# EAGLE schematic glove (EAGLE 6.6.0)

## Sheet 1 of 4
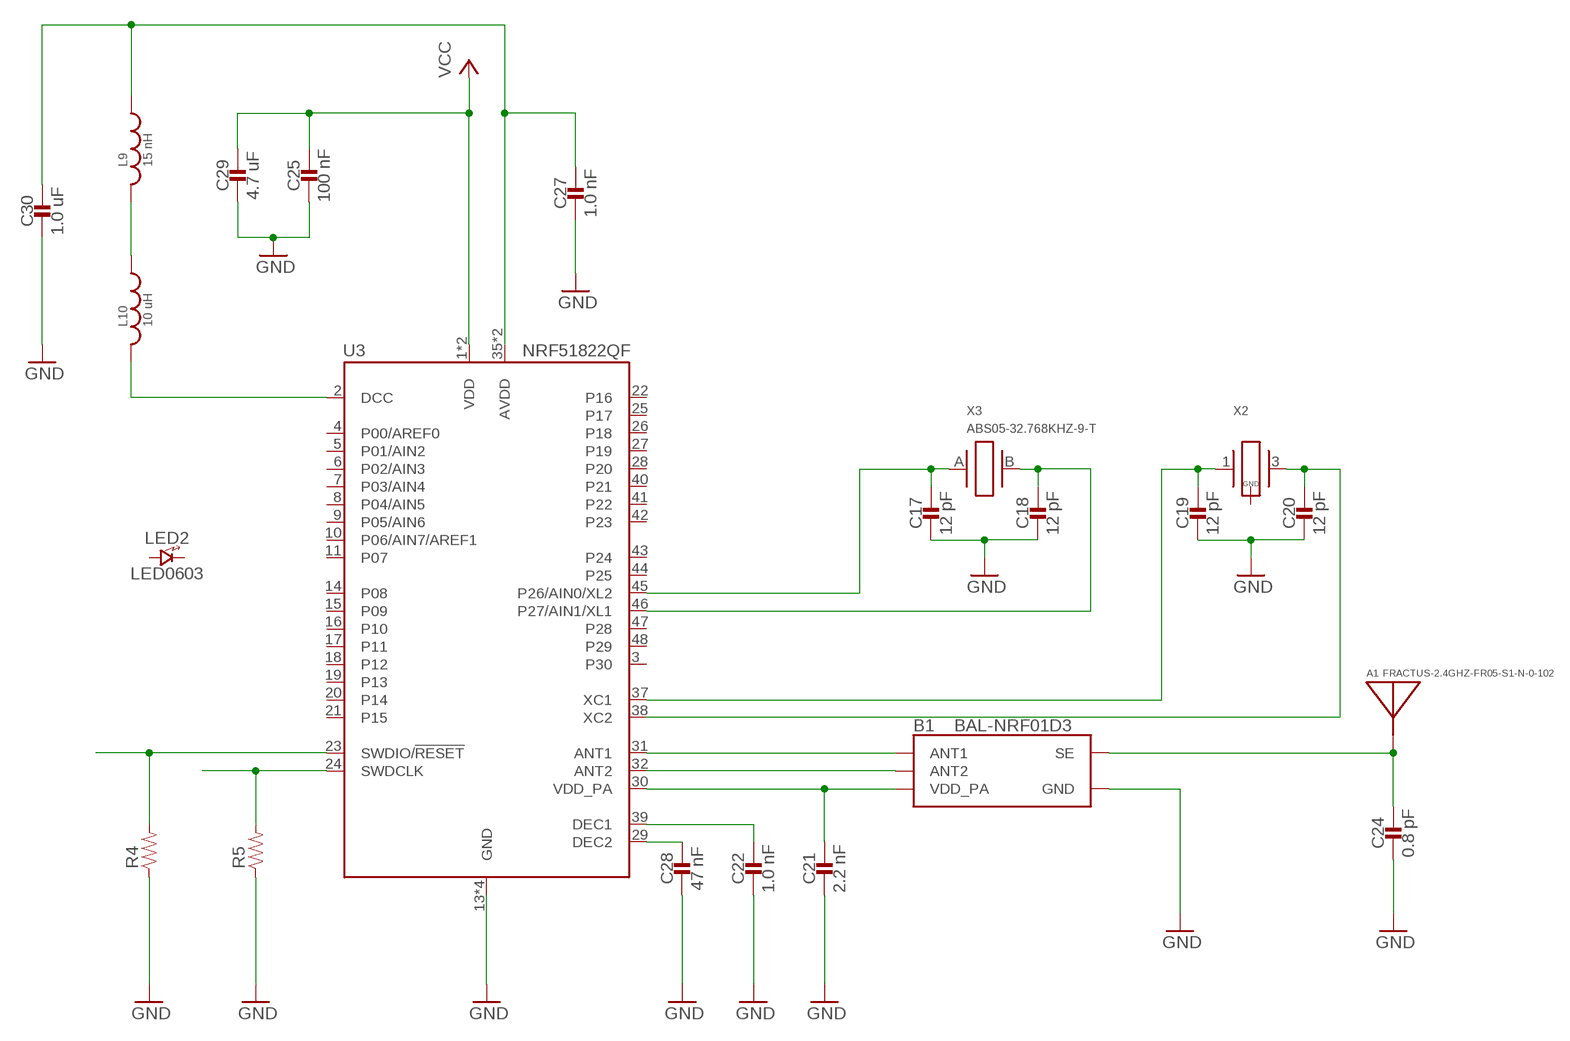
[diagram p0: schematic, sheet 1]

### Parts
A1  FRACTUS-2.4GHZ-FR05-S1-N-0-102  [FRACTUS-ANTENNA-FR05-S1-N-0-102]
B1  BAL-NRF01D3  [BAL-NRF01D3]
C17  12 pF  CAPACITOR0402_CAP  [0402_CAP]
C18  12 pF  CAPACITOR0402_CAP  [0402_CAP]
C19  12 pF  CAPACITOR0402_CAP  [0402_CAP]
C20  12 pF  CAPACITOR0402_CAP  [0402_CAP]
C21  2.2 nF  CAPACITOR0402_CAP  [0402_CAP]
C22  1.0 nF  CAPACITOR0402_CAP  [0402_CAP]
C24  0.8 pF  CAPACITOR0402_CAP  [0402_CAP]
C25  100 nF  CAPACITOR0402_CAP  [0402_CAP]
C27  1.0 nF  CAPACITOR0402_CAP  [0402_CAP]
C28  47 nF  CAPACITOR0402_CAP  [0402_CAP]
C29  4.7 uF  CAPACITOR0603_CAP  [0603_CAP]
C30  1.0 uF  CAPACITOR0603_CAP  [0603_CAP]
L9  15 nH  INDUCTOR0402  [0402_CAP]
L10  10 uH  INDUCTOR0603  [0603_CAP]
LED2  LED0603  [LED-0603]
R4  RESISTOR0603_RES  [0603-RES]
R5  RESISTOR0603_RES  [0603-RES]
U3  NRF51822QF  [QFN-48-6MM]
X2  TXC-8Y  [TXC-8Y]
X3  ABS05-32.768KHZ-9-T  [ABS05]

### Nets
GND: B1.GND C17.2 C18.2 C19.2 C20.2 C21.2 C22.2 C24.2 C25.2 C27.2 C28.2 C29.2 C30.2 R4.1 R5.1 U3.13(GND) U3.33(GND) U3.34(GND) U3.GND ; also sheet 2,3,4
N$14: L10.2 U3.2(DCC)
N$15: L9.2 L10.1
N$16: C27.1 C30.1 L9.1 U3.35(AVDD) U3.36(AVDD)
N$19: R4.2 U3.23(SWDIO/!RESET)
N$20: C20.1 U3.38(XC2) X2.3
N$21: B1.ANT1 U3.31(ANT1)
N$22: B1.ANT2 U3.32(ANT2)
N$23: B1.VCC(VDD_PA) C21.1 U3.30(VDD_PA)
N$24: A1.1(ANTENNA) B1.SE C24.1
N$25: C28.1 U3.29(DEC2)
N$26: C22.1 U3.39(DEC1)
N$27: C17.1 U3.45(P26/AIN0/XL2) X3.A
N$28: C18.1 U3.46(P27/AIN1/XL1) X3.B
N$29: C19.1 U3.37(XC1) X2.1
N$30: R5.2 U3.24(SWDCLK)
VCC: C25.1 C29.1 U3.1(VDD) U3.12(VDD) ; also sheet 3,4
Unconnected: LED2.A(ANODE) LED2.C(CATHODE) U3.3(P30) U3.4(P00/AREF0) U3.5(P01/AIN2) U3.6(P02/AIN3) U3.7(P03/AIN4) U3.8(P04/AIN5) U3.9(P05/AIN6) U3.10(P06/AIN7/AREF1) U3.11(P07) U3.14(P08) U3.15(P09) U3.16(P10) U3.17(P11) U3.18(P12) U3.19(P13) U3.20(P14) U3.21(P15) U3.22(P16) U3.25(P17) U3.26(P18) U3.27(P19) U3.28(P20) U3.40(P21) U3.41(P22) U3.42(P23) U3.43(P24) U3.44(P25) U3.47(P28) U3.48(P29) X2.2(GND) X2.4(GND)

## Sheet 2 of 4
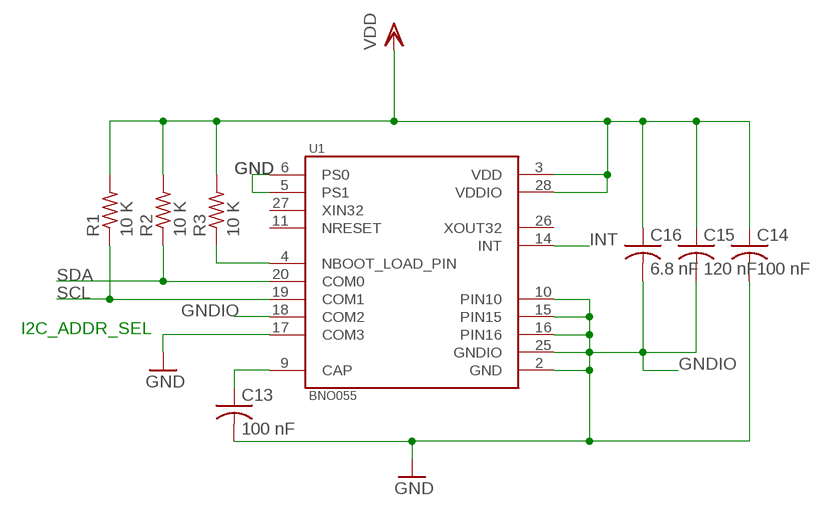
[diagram p1: schematic, sheet 2]

### Parts
C13  100 nF  C-USC0603  [C0603]
C14  100 nF  C-USC0603  [C0603]
C15  120 nF  C-USC0603  [C0603]
C16  6.8 nF  C-USC0603  [C0603]
R1  10 K  R-US_R0603  [R0603]
R2  10 K  R-US_R0603  [R0603]
R3  10 K  R-US_R0603  [R0603]
U1  BNO055  [LGA28R50P4X10_380X520X100]

### Nets
GND: U1.5(PS1) U1.6(PS0) U1.17(COM3) ; also sheet 1,3,4
GNDIO: C13.2 C14.2 C15.2 C16.2 U1.2(GND) U1.10(PIN10) U1.15(PIN15) U1.16(PIN16) U1.18(COM2) U1.25(GNDIO) ; supply symbol labelled GND
INT: U1.14(INT)
N$9: C13.1 U1.9(CAP)
N$18: R3.1 U1.4(NBOOT_LOAD_PIN)
SCL: R1.1 U1.19(COM1) ; also sheet 3
SDA: R2.1 U1.20(COM0) ; also sheet 3
VDD: C14.1 C15.1 C16.1 R1.2 R2.2 R3.2 U1.3(VDD) U1.28(VDDIO)
Unconnected: U1.11(NRESET) U1.26(XOUT32) U1.27(XIN32)

### Notes on the sheet
- I2C_ADDR_SEL

## Sheet 3 of 4
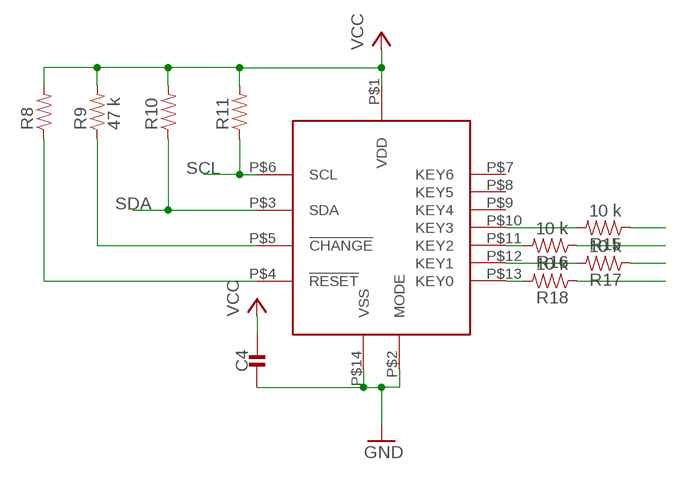
[diagram p2: schematic, sheet 3]

### Parts
C4  CAPACITOR0603_CAP  [0603_CAP]
R8  RESISTOR0603_RES  [0603-RES]
R9  47 k  RESISTOR0603_RES  [0603-RES]
R10  RESISTOR0603_RES  [0603-RES]
R11  RESISTOR0603_RES  [0603-RES]
R15  10 k  RESISTOR0603_RES  [0603-RES]
R16  10 k  RESISTOR0603_RES  [0603-RES]
R17  10 k  RESISTOR0603_RES  [0603-RES]
R18  10 k  RESISTOR0603_RES  [0603-RES]
U$1  COMMS  [QT1070]

### Nets
GND: C4.2 U$1.P$2(MODE) U$1.P$14(VSS) ; also sheet 1,2,4
N$17: R9.1 U$1.P$5(!CHANGE)
N$31: R15.2 U$1.P$10(KEY3)
N$32: R15.1
N$33: R16.2 U$1.P$11(KEY2)
N$34: R16.1
N$35: R17.2 U$1.P$12(KEY1)
N$36: R17.1
N$37: R18.2 U$1.P$13(KEY0)
N$39: R18.1
N$40: R8.1 U$1.P$4(!RESET)
SCL: R11.1 U$1.P$6(SCL) ; also sheet 2
SDA: R10.1 U$1.P$3(SDA) ; also sheet 2
VCC: C4.1 R8.2 R9.2 R10.2 R11.2 U$1.P$1(VDD) ; also sheet 1,4
Unconnected: U$1.P$7(KEY6) U$1.P$8(KEY5) U$1.P$9(KEY4)

## Sheet 4 of 4
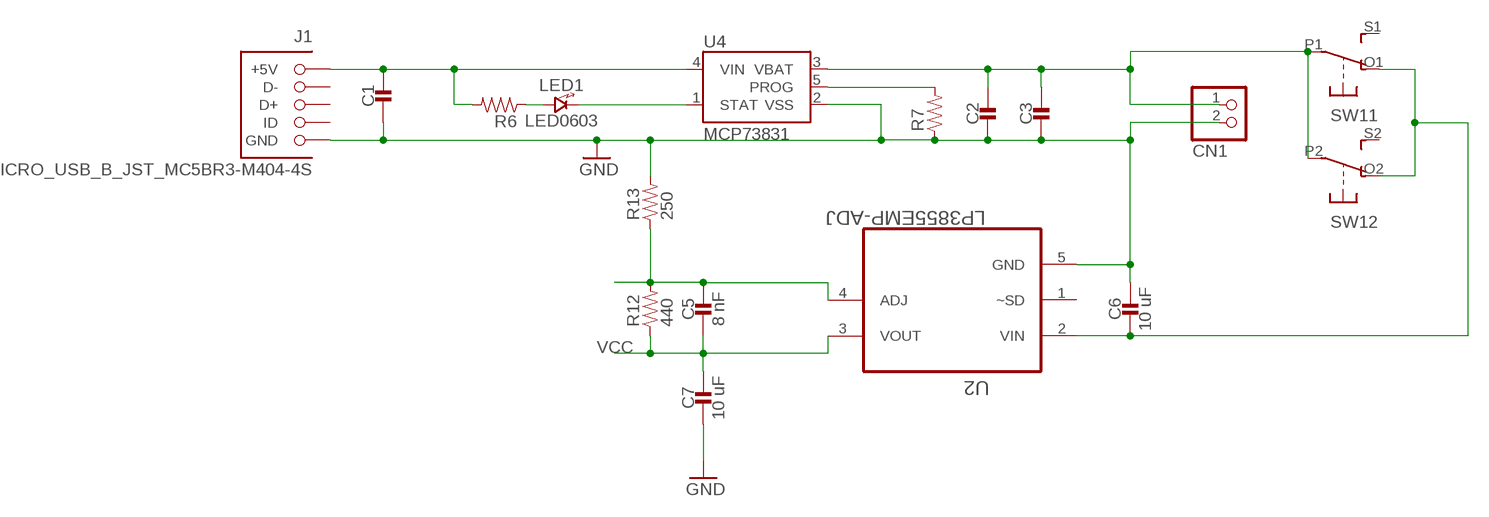
[diagram p3: schematic, sheet 4]

### Parts
C1  CAPACITOR0603_CAP  [0603_CAP]
C2  CAPACITOR0603_CAP  [0603_CAP]
C3  CAPACITOR0603_CAP  [0603_CAP]
C5  8 nF  CAPACITOR0603_CAP  [0603_CAP]
C6  10 uF  CAPACITOR0603_CAP  [0603_CAP]
C7  10 uF  CAPACITOR0603_CAP  [0603_CAP]
CN1  JST_2PIN-SMT-RA  [JST-PH-2-SMT-RA]
J1  MICRO_USB_B_JST_MC5BR3-M404-4S  [USB_MICRO_B-JST-MC5BR3-M404-4S-TB]
LED1  LED0603  [LED-0603]
R6  RESISTOR0603_RES  [0603-RES]
R7  RESISTOR0603_RES  [0603-RES]
R12  440  RESISTOR0603_RES  [0603-RES]
R13  250  RESISTOR0603_RES  [0603-RES]
SW1  DPDT-EG1390  [EG1390]
U2  LP3855EMP-ADJ  [SOT150P696X180-5N]
U4  MCP73831  [SOT23-5]

### Nets
GND: C1.2 C2.2 C3.2 C6.1 C7.2 CN1.2 J1.5(GND) R7.1 R13.2 U2.5(GND) U4.2(VSS) ; also sheet 1,2,3
N$1: C2.1 C3.1 CN1.1 SW1.P1(1:P) SW1.P2(2:P) U4.3(VBAT)
N$2: LED1.A(ANODE) R6.1
N$3: LED1.C(CATHODE) U4.1(STAT)
N$4: R7.2 U4.5(PROG)
N$5: C6.2 SW1.O1(1:O) SW1.O2(2:O) U2.2(VIN)
N$7: C5.1 R12.2 R13.1 U2.4(ADJ)
N$38: C1.1 J1.1(+5V) R6.2 U4.4(VIN)
VCC: C5.2 C7.1 R12.1 U2.3(VOUT) ; also sheet 1,3
Unconnected: J1.2(D-) J1.3(D+) J1.4(ID) SW1.S1(1:S) SW1.S2(2:S) U2.1(~SD)

## Library data of the parts
A1 = chips:FRACTUS-2.4GHZ-FR05-S1-N-0-102: Fractus Compact Reach XtendTM chip antenna is engineered specifically for Bluetooth, WLAN 802.11 b/g/n and other wireless devices operating at the ISM 2.4 GHz band. Compact Reach Xtend combines small form factor size and high performance to improve the functionality of your wireless devices.; RICHARDSON_RFPD: FR05-S1-N-0102B
B1 = chips:BAL-NRF01D3: 50 ohm nominal input / conjugate match balun to nRF51422-QFAA, nRF24LE1, nRF51822-QFAA/AB, with integrated harmonic filter; DIGIKEY: 497-13637-1-ND; MOUSER: 511-BAL-NRF01D3
C1-C7 C17-C22 C24 C25 C27-C30 = passives:CAPACITOR: 0402 Capacitor
C13-C16 = rcl:C-US: CAPACITOR, American symbol
CN1 = adafruit:JST_2PIN: JST 2-Pin Connectors of various flavors SMT-RA (S2B-PH-SM4) 4UConnector #17311 SMT (B2B-PH-SM4) THM-RA (S2B-PH) THM (B2B-PH)
J1 = connector:MICRO_USB_B_JST_MC5BR3-M404-4S: Micro USB B mid mount; DIGIKEY: 455-2567-2-ND; MOUSER: 53X3655
L9 L10 = passives:INDUCTOR: A very specific inductor
LED1 LED2 = leds:LED: LED
R1-R3 = rcl:R-US_: RESISTOR, American symbol
R4-R13 R15-R18 = passives:RESISTOR: Resistor Basic schematic elements and footprints for 0603, 1206, and PTH resistors.
SW1 = adafruit:DPDT
U1 = BNO055:BNO055: BNO055 9-axis Absolute Orientation Sensor ( SiP ) w/Sensors and Sensor Fusion; AVAILABILITY: Good; DESCRIPTION: BNO055 9-axis Absolute Orientation Sensor ( SiP ) w/Sensors and Sensor Fusion; MF: Bosch; MP: BNO055; PACKAGE: LGA-28 Bosch; PRICE: 9.48 USD
U2 = LP3855EMP-ADJ:LP3855EMP-ADJ: Linear Regulators; AVAILABILITY: Good; DESCRIPTION: 1.5A Fast Response Ultra Low Dropout Linear Regulators 5-SOT-223 -40 to 125; MF: Texas Instruments; MP: LP3855EMP-ADJ; PACKAGE: SOT-223 Texas Instruments; PRICE: 3.03 USD
U3 = chips:NRF51822: Multiprotocol Bluetooth® 4.0 low energy/2.4 GHz RF SoC; DIGIKEY: 1490-1032-1-ND; MOUSER: 949-NRF51822-QFAB-R7
U4 = SparkFun-PowerIC:MCP73831: Miniature single cell, fully integrated Li-Ion, Li-polymer charge management controller http://ww1.microchip.com/downloads/en/DeviceDoc/21984a.pdf
U$1 = QT1070:COMMS
X2 = crystals:TXC-8Y: 2mmx1.6mm SMD Crystal
X3 = crystals:ABS05-32.768KHZ: 32.768kHz Crystal; DIGIKEY: 535-11897-1-ND